# Altium schematic sheet PowerControl.SchDoc
size A0
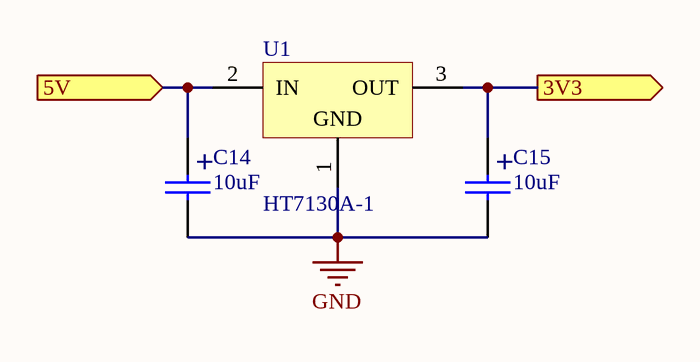
[diagram p0: PowerControl.SchDoc]

## Parts
C14  10uF  [CAP100RP]
C15  10uF  [CAP100RP]
U1  HT7130A-1  [BCY-W3/E4]

## Ports
3V3 (out), 5V (in)

## Nets
GND: C14.2 C15.2 U1.1(GND)
3V3: C15.1 U1.3(OUT) ; port 3V3
5V: C14.1 U1.2(IN) ; port 5V

## Notes on the sheet
- (in symbol CAPPOL) +

## Library data of the parts
C14 C15 = CAPPOL
U1 = HT7130A-1: 3.0V 30mA Low Power,  Low Dropout Voltage (LDO) Regulator; Published: 30-Mar-2007; DatasheetVersion: rev1.50, Jan-2006; PackageVersion: Jan-2006; PackageReference: TO-92; Publisher: Altium Limited; PackageDescription: TO, Flat Index; 3 In-Line, Axial Leads; Body Dia. 4.7mm; Lead Dia. 0.51 mm (max); ComponentLink1Description: Manufacturer Link; ComponentLink1URL: http://www.holtek.com/; ComponentLink2Description: Datasheet; ComponentLink2URL: http://www.holtek.com/pdf/consumer/71xx_1v150.pdf